# Altium project AD9834.PrjPcb
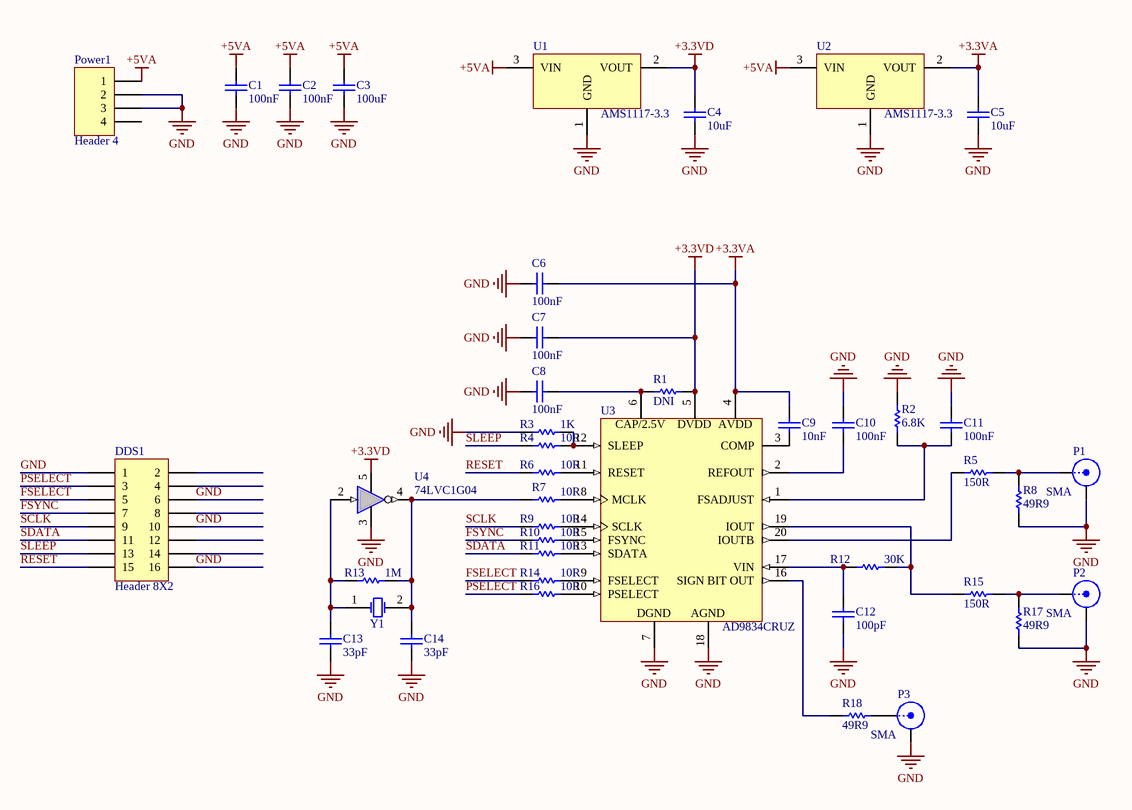
[diagram p0: AD9834.SchDoc]
1 sheet, 42 parts. Net scope: global (net labels, ports and power ports of the same name join across sheets).
Board file: AD9834.PcbDoc

## Sheet AD9834.SchDoc
size A4

### Parts
C1  100nF  [CAPC0603(1608)55_M]
C2  100nF  [CAPC0603(1608)55_M]
C3  100uF  [CAPC3225]
C4  10uF  [CAPC0805(2012)75_M]
C5  10uF  [CAPC0805(2012)75_M]
C6  100nF  [CAPC0603(1608)55_M]
C7  100nF  [CAPC0603(1608)55_M]
C8  100nF  [CAPC0603(1608)55_M]
C9  10nF  [CAPC0603(1608)55_M]
C10  100nF  [CAPC0603(1608)55_M]
C11  100nF  [CAPC0603(1608)55_M]
C12  100pF  [CAPC0603(1608)55_M]
C13  33pF  [CAPC0603(1608)55_M]
C14  33pF  [CAPC0603(1608)55_M]
DDS1  Header 8X2  [Header8X2]
P1  SMA  [SMA-V]
P2  SMA  [SMA-V]
P3  SMA  [SMA-V]
Power1  Header 4  [3.96-4]
R1  DNI  [RESC0603(1608)_M]
R2  6.8K  [RESC0603(1608)_M]
R3  1K  [RESC0603(1608)_M]
R4  10R  [RESC0603(1608)_M]
R5  150R  [RESC0603(1608)_M]
R6  10R  [RESC0603(1608)_M]
R7  10R  [RESC0603(1608)_M]
R8  49R9  [RESC0603(1608)_M]
R9  10R  [RESC0603(1608)_M]
R10  10R  [RESC0603(1608)_M]
R11  10R  [RESC0603(1608)_M]
R12  30K  [RESC0603(1608)_M]
R13  1M  [RESC0603(1608)_M]
R14  10R  [RESC0603(1608)_M]
R15  150R  [RESC0603(1608)_M]
R16  10R  [RESC0603(1608)_M]
R17  49R9  [RESC0603(1608)_M]
R18  49R9  [RESC0603(1608)_M]
U1  AMS1117-3.3  [SOT-223_M]
U2  AMS1117-3.3  [SOT-223_M]
U3  AD9834CRUZ  [RU-20]
U4  74LVC1G04  [SOT753]
Y1  XTAL  [HC-49S]  (value not drawn)

### Nets
+3.3VA: C5.2 C6.2 C9.2 U2.2(VOUT) U3.4(AVDD)
+3.3VD: C4.2 C7.2 R1.1 U1.2(VOUT) U3.5(DVDD) U4.5(VCC)
+5VA: C1.2 C2.2 C3.2 Power1.1 U1.3(VIN) U2.3(VIN)
GND: C1.1 C2.1 C3.1 C4.1 C5.1 C6.1 C7.1 C8.1 C10.2 C11.2 C12.1 C13.1 C14.1 DDS1.1 DDS1.6 DDS1.10 DDS1.16 P1.2(Y) P2.2(Y) P3.2(Y) Power1.2 Power1.3 R2.1 R3.2 R8.2 R17.2 U1.1(GND) U2.1(GND) U3.7(DGND) U3.18(AGND) U4.3(GND)
FSELECT: DDS1.5 R14.2
FSYNC: DDS1.7 R10.2
PSELECT: DDS1.3 R16.2
RESET: DDS1.15 R6.2
SCLK: DDS1.9 R9.2
SDATA: DDS1.11 R11.2
SLEEP: DDS1.13 R4.2
NetC8_2: C8.2 R1.2 U3.6(CAP/2.5V)
NetC9_1: C9.1 U3.3(COMP)
NetC10_1: C10.1 U3.2(REFOUT)
NetC11_1: C11.1 R2.2 U3.1(FSADJUST)
NetC12_2: C12.2 R12.2 U3.17(VIN)
NetC13_2: C13.2 R13.2 U4.2(A) Y1.1(OSC1)
NetC14_2: C14.2 R7.2 R13.1 U4.4(Y) Y1.2(OSC2)
NetP1_1: P1.1(X) R5.1 R8.1
NetP2_1: P2.1(X) R15.1 R17.1
NetP3_1: P3.1(X) R18.1
NetR3_1: R3.1 R4.1 U3.12(SLEEP)
NetR5_2: R5.2 U3.20(IOUTB)
NetR6_1: R6.1 U3.11(RESET)
NetR7_1: R7.1 U3.8(MCLK)
NetR9_1: R9.1 U3.14(SCLK)
NetR10_1: R10.1 U3.15(FSYNC)
NetR11_1: R11.1 U3.13(SDATA)
NetR12_1: R12.1 R15.2 U3.19(IOUT)
NetR14_1: R14.1 U3.9(FSELECT)
NetR16_1: R16.1 U3.10(PSELECT)
NetR18_2: R18.2 U3.16(SIGN_BIT_OUT)

Not connected (* = marked no-connect by the designer): DDS1 2 4 8 12 14; Power1 4

### Library data of the parts
C1-C14 = CAP
DDS1 = Header 8X2: Header, 8-Pin, Dual row; LatestRevisionDate: 17-Jul-2002; LatestRevisionNote: Re-released for DXP Platform.; Publisher: Altium Limited
Power1 = Header 4: Header, 4-Pin; Manufacturer: Generic Components; Class: Connector
R1-R18 = RES
U1 U2 = AMS1117
Y1 = XTAL: Crystal Oscillator; Published: 8-Jun-2000; LatestRevisionDate: 17-Jul-2002; LatestRevisionNote: Re-released for DXP Platform.; PackageReference: R38; Publisher: Altium Limited; PackageDescription: Crystal, Thru-Hole; 2 Leads; Body 3.1 x 8.2 mm (Dia.xH)
P1-P3 = SMA: LatestRevisionDate: 17-Jul-2002; LatestRevisionNote: Re-released for DXP Platform.; Publisher: Altium Limited